# Altium project khoacuathongminh.PrjPcb
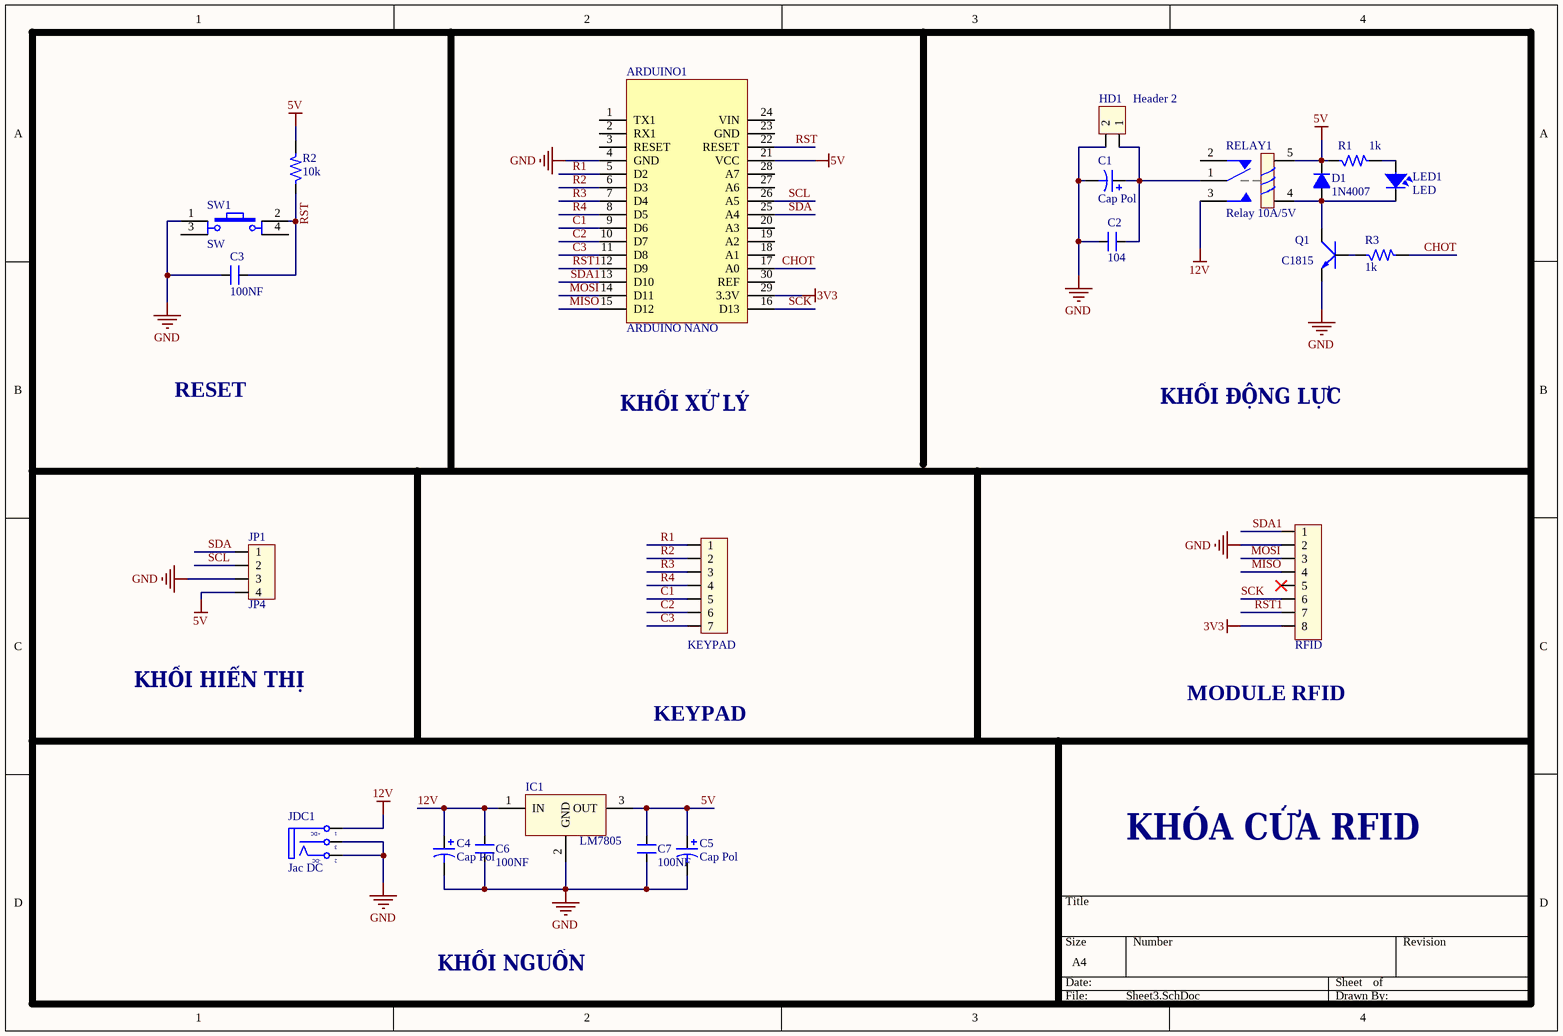
[diagram p0: Sheet3.SchDoc]
1 sheet, 22 parts. Net scope: global (net labels, ports and power ports of the same name join across sheets).
Board file: PCB5.PcbDoc

## Sheet Sheet3.SchDoc
size A4; SheetNumber: 1; SheetTotal: 1

### Parts
ARDUINO1  ARDUINO NANO  [ARDUINO PRO NANO]
C1  Cap Pol  [C3MM]
C2  104  [CN1]
C3  100NF  [CN1]
C4  Cap Pol  [C3MM]
C5  Cap Pol  [C3MM]
C6  100NF  [CN1]
C7  100NF  [CN1]
D1  1N4007  [D1A]
H1  RFID  [XH2.54M-8]
H2  KEYPAD  [XH2.54M-7]
HD1  Header 2  [HED2]
IC1  LM7805  [QTO-220]
JDC1  Jac DC  [DC-IN]
JP1  JP4  [CON4]
LED1  LED  [LED-3]
Q1  C1815  [QTO-92]
R1  1k  [RES-1/4W]
R2  10k  [RES-1/4W]
R3  1k  [RES-1/4W]
RELAY1  Relay 10A/5V  [RL_SPDT_10A - duplicate]
SW1  SW  [SW4]

### Nets
3V3: ARDUINO1.29(3.3V) H1.8
5V: ARDUINO1.21(VCC) C5.1 C7.2 D1.2(K) IC1.3(OUT) JP1.4 R1.1 R2.2 RELAY1.5
12V: C4.1 C6.2 IC1.1(IN) JDC1.1(T) RELAY1.3
GND: ARDUINO1.4(GND) C1.2 C2.2 C3.1 C4.2 C5.2 C6.1 C7.1 H1.2 HD1.2 IC1.2(GND) JDC1.2(TN) JDC1.3(S) JP1.3 Q1.1(E) SW1.1
C1: ARDUINO1.9(D6) H2.5
C2: ARDUINO1.10(D7) H2.6
C3: ARDUINO1.11(D8) H2.7
CHOT: ARDUINO1.17(A0) R3.2
MISO: ARDUINO1.15(D12) H1.4
MOSI: ARDUINO1.14(D11) H1.3
R1: ARDUINO1.5(D2) H2.1
R2: ARDUINO1.6(D3) H2.2
R3: ARDUINO1.7(D4) H2.3
R4: ARDUINO1.8(D5) H2.4
RST: ARDUINO1.22(RESET) C3.2 R2.1 SW1.2
RST1: ARDUINO1.12(D9) H1.7
SCK: ARDUINO1.16(D13) H1.6
SCL: ARDUINO1.26(A5) JP1.2
SDA: ARDUINO1.25(A4) JP1.1
SDA1: ARDUINO1.13(D10) H1.1
NetC1_1: C1.1 C2.1 HD1.1 RELAY1.1
NetD1_1: D1.1(A) LED1.2 Q1.2(C) RELAY1.4
NetLED1_1: LED1.1 R1.2
NetQ1_3: Q1.3(B) R3.1

Not connected (* = marked no-connect by the designer): ARDUINO1 1(TX1) 2(RX1) 3(RESET) 18(A1) 19(A2) 20(A3) 23(GND) 24(VIN) 27(A6) 28(A7) 30(REF); H1 5*; RELAY1 2; SW1 3 4

### Notes on the sheet
- RESET
- KHỐI XỬ LÝ
- KHỐI ĐỘNG LỰC
- KHỐI HIỂN THỊ
- MODULE RFID
- KEYPAD
- KHÓA CỬA RFID
- KHỐI NGUỒN
- (in symbol DCIN) +DC; -DC

### Library data of the parts
C1 C4 C5 = Cap Pol: Polarized Capacitor (Axial); Published: 8-Jun-2000; LatestRevisionDate: 17-Jul-2002; LatestRevisionNote: Re-released for DXP Platform.; PackageReference: POLAR0.8; Publisher: Altium Limited
C2 C3 C6 C7 = CN1: Cap np  1pF - 472pF; Value: 100pF
D1 = D1A: Diode 1A; Value: 1N4007
H1 = Header 8P 2.54 Duc Thang: Cắm; Ten_Linh_Kien: Header 8P XH2.54-8P Đực Thẳng; Don_Vi: Con; Ma_Hang: MH003366; Chung_Loai: Cắm
H2 = Header 7P 2.54 Duc Thang: Cắm; Ten_Linh_Kien: Header 7P XH2.54-7P Đực Thẳng; Don_Vi: Con; Ma_Hang: MH003369; Chung_Loai: Cắm
HD1 = Hed2: Header 2 (Green); Value: Header 2
IC1 = LM78xx: On ap +, from + 5 to + 24VDC; Value: LM7805
JDC1 = DCIN: Jac DC input; Value: Jac DC
JP1 = Con4: Connector 4; Value: Connector 4
LED1 = LED: LED Single colour Green and Red; Value: LED 3 ly Single Colour
Q1 = C1815: NPN 600mW, ECB; Value: C1815
R1-R3 = R: Resistor 1/4W; Value: R1/4W - 1K
RELAY1 = Relay 1: Relay SPDT,10A - 12VDC 5 Pin; Value: Relay SPDT, 10A, 12V
SW1 = SW4: Switch button 4 pin; Value: Button chip 4 pin